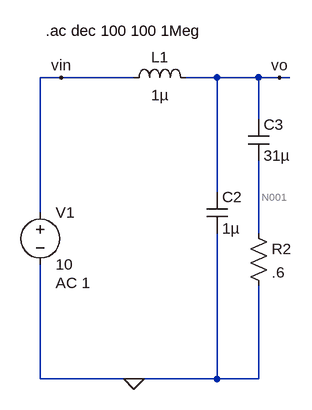
[diagram p0: schematic problem2-9_3.asc]
problem2-9_3.asc, the LTspice schematic file:
Version 4
SHEET 1 1032 680
WIRE -48 -208 -80 -208
WIRE 64 -208 -48 -208
WIRE 192 -208 144 -208
WIRE 256 -208 192 -208
WIRE 288 -208 256 -208
WIRE 304 -208 288 -208
WIRE 256 -144 256 -208
WIRE 192 -32 192 -208
WIRE -80 0 -80 -208
WIRE 256 32 256 -80
WIRE -80 256 -80 80
WIRE 64 256 -80 256
WIRE 192 256 192 32
WIRE 192 256 64 256
WIRE 256 256 256 112
WIRE 256 256 192 256
FLAG -48 -208 vin
FLAG 288 -208 vo
FLAG 64 256 0
SYMBOL ind 48 -192 R270
WINDOW 0 32 56 VTop 2
WINDOW 3 5 56 VBottom 2
SYMATTR InstName L1
SYMATTR Value 1µ
SYMATTR SpiceLine Rser=1m Rpar=1Meg
SYMBOL voltage -80 -16 R0
WINDOW 123 24 124 Left 2
WINDOW 39 0 0 Left 0
SYMATTR Value2 AC 1
SYMATTR InstName V1
SYMATTR Value 10
SYMBOL cap 176 -32 R0
SYMATTR InstName C2
SYMATTR Value 1µ
SYMBOL res 240 16 R0
SYMATTR InstName R2
SYMATTR Value .6
SYMBOL cap 240 -144 R0
SYMATTR InstName C3
SYMATTR Value 31µ
TEXT -72 -280 Left 2 !.ac dec 100 100 1Meg

The netlist it stands for:
* problem2-9_3.asc
L1 vin vo 1µ Rser=1m Rpar=1Meg
V1 vin 0 10 AC 1
C2 vo 0 1µ
R2 N001 0 .6
C3 vo N001 31µ
.ac dec 100 100 1Meg
.backanno
.end

* Results of the author's LTspice run, read from the files saved beside the schematic
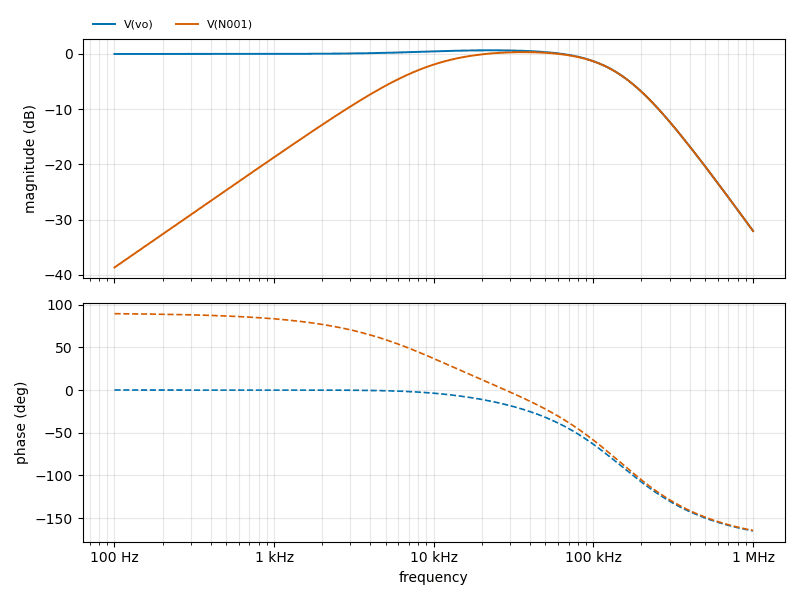
[diagram p1: AC Analysis of problem2-9_3.asc, plotted from the saved traces]
* AC Analysis, 1 run:
*   V(vo): 0.00 dB at 100 Hz, -32.03 dB at 1 MHz, peak 0.66 dB at 22.39 kHz, 3 dB below the peak at 121.6 kHz
*   V(N001): -38.65 dB at 100 Hz, -32.03 dB at 1 MHz, peak 0.33 dB at 36.31 kHz, 3 dB below the peak at 8.423 kHz and 127.6 kHz